# Altium schematic sheet Top_Level.SchDoc
size A; SheetNumber: 1; SheetTotal: 8
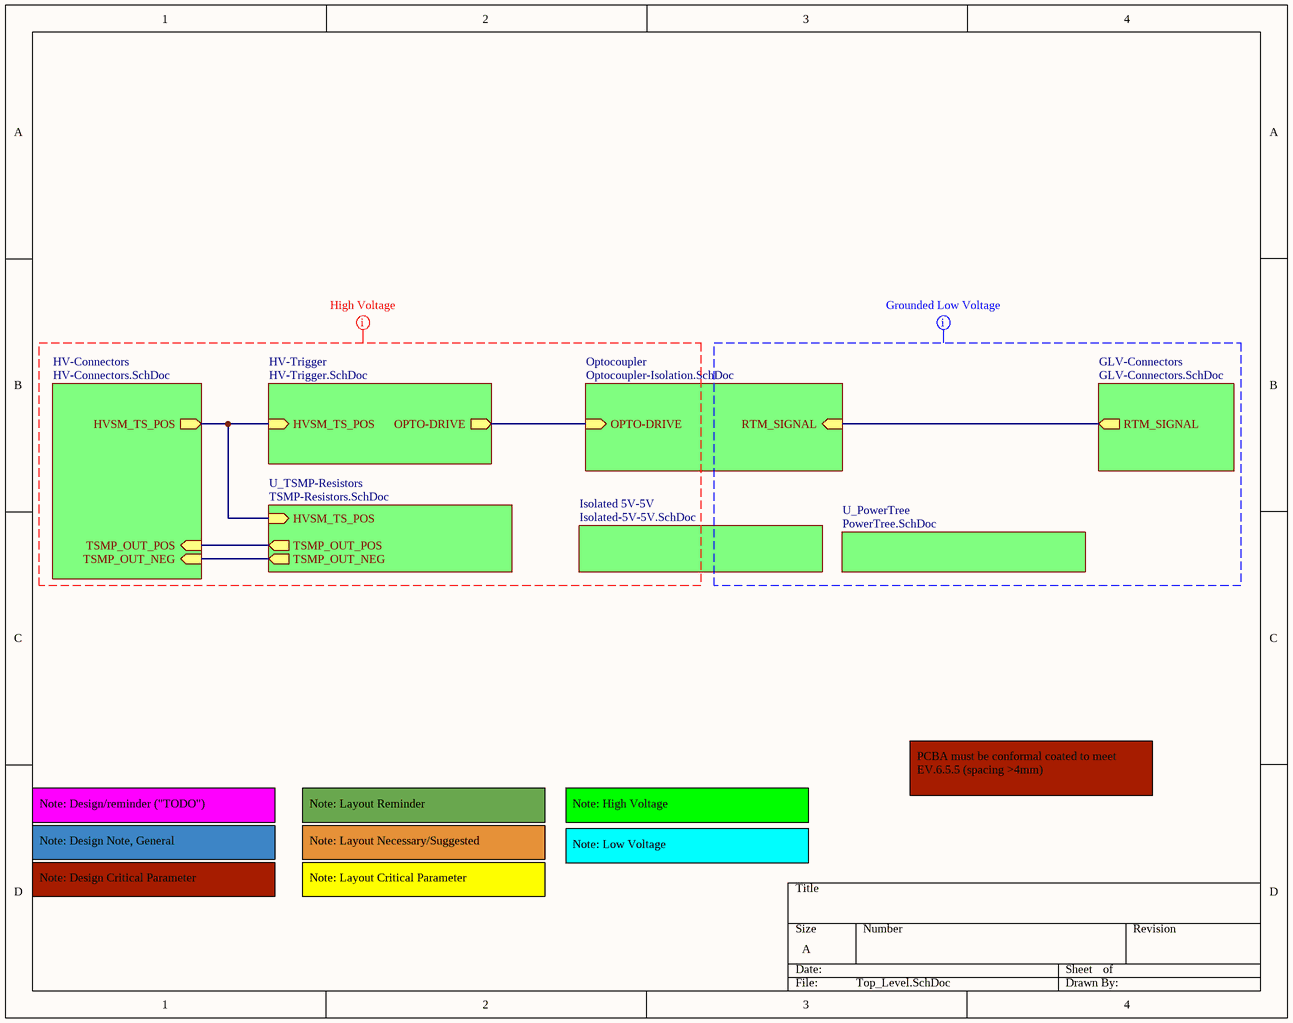
[diagram p0: Top_Level.SchDoc]

## Sub-sheets
GLV-Connectors = GLV-Connectors.SchDoc: RTM_SIGNAL (out)
HV-Connectors = HV-Connectors.SchDoc: HVSM_TS_POS (out), TSMP_OUT_POS (in), TSMP_OUT_NEG (in)
HV-Trigger = HV-Trigger.SchDoc: HVSM_TS_POS (in), OPTO-DRIVE (out)
Isolated 5V-5V = Isolated-5V-5V.SchDoc: no entries
Optocoupler = Optocoupler-Isolation.SchDoc: RTM_SIGNAL (in), OPTO-DRIVE (in)
U_PowerTree = PowerTree.SchDoc: no entries
U_TSMP-Resistors = TSMP-Resistors.SchDoc: TSMP_OUT_POS (out), TSMP_OUT_NEG (out), HVSM_TS_POS (in)

## Nets
(unnamed): sheet HV-Connectors/HVSM_TS_POS, sheet HV-Trigger/HVSM_TS_POS, sheet U_TSMP-Resistors/HVSM_TS_POS
(unnamed): sheet HV-Connectors/TSMP_OUT_POS, sheet U_TSMP-Resistors/TSMP_OUT_POS
(unnamed): sheet HV-Connectors/TSMP_OUT_NEG, sheet U_TSMP-Resistors/TSMP_OUT_NEG
(unnamed): sheet HV-Trigger/OPTO-DRIVE, sheet Optocoupler/OPTO-DRIVE
(unnamed): sheet Optocoupler/RTM_SIGNAL, sheet GLV-Connectors/RTM_SIGNAL

## Layout directives
mark named High Voltage: (no net found under the mark)
mark named Grounded Low Voltage: (no net found under the mark)

## Notes on the sheet
- Note: Design/reminder ("TODO")
- Note: Layout Reminder
- Note: High Voltage
- PCBA must be conformal coated to meet EV.6.5.5 (spacing >4mm)
- Note: Design Note, General
- Note: Design Critical Parameter
- Note: Layout Necessary/Suggested
- Note: Layout Critical Parameter
- Note: Low Voltage